# EAGLE design v2 (EAGLE 6.1)
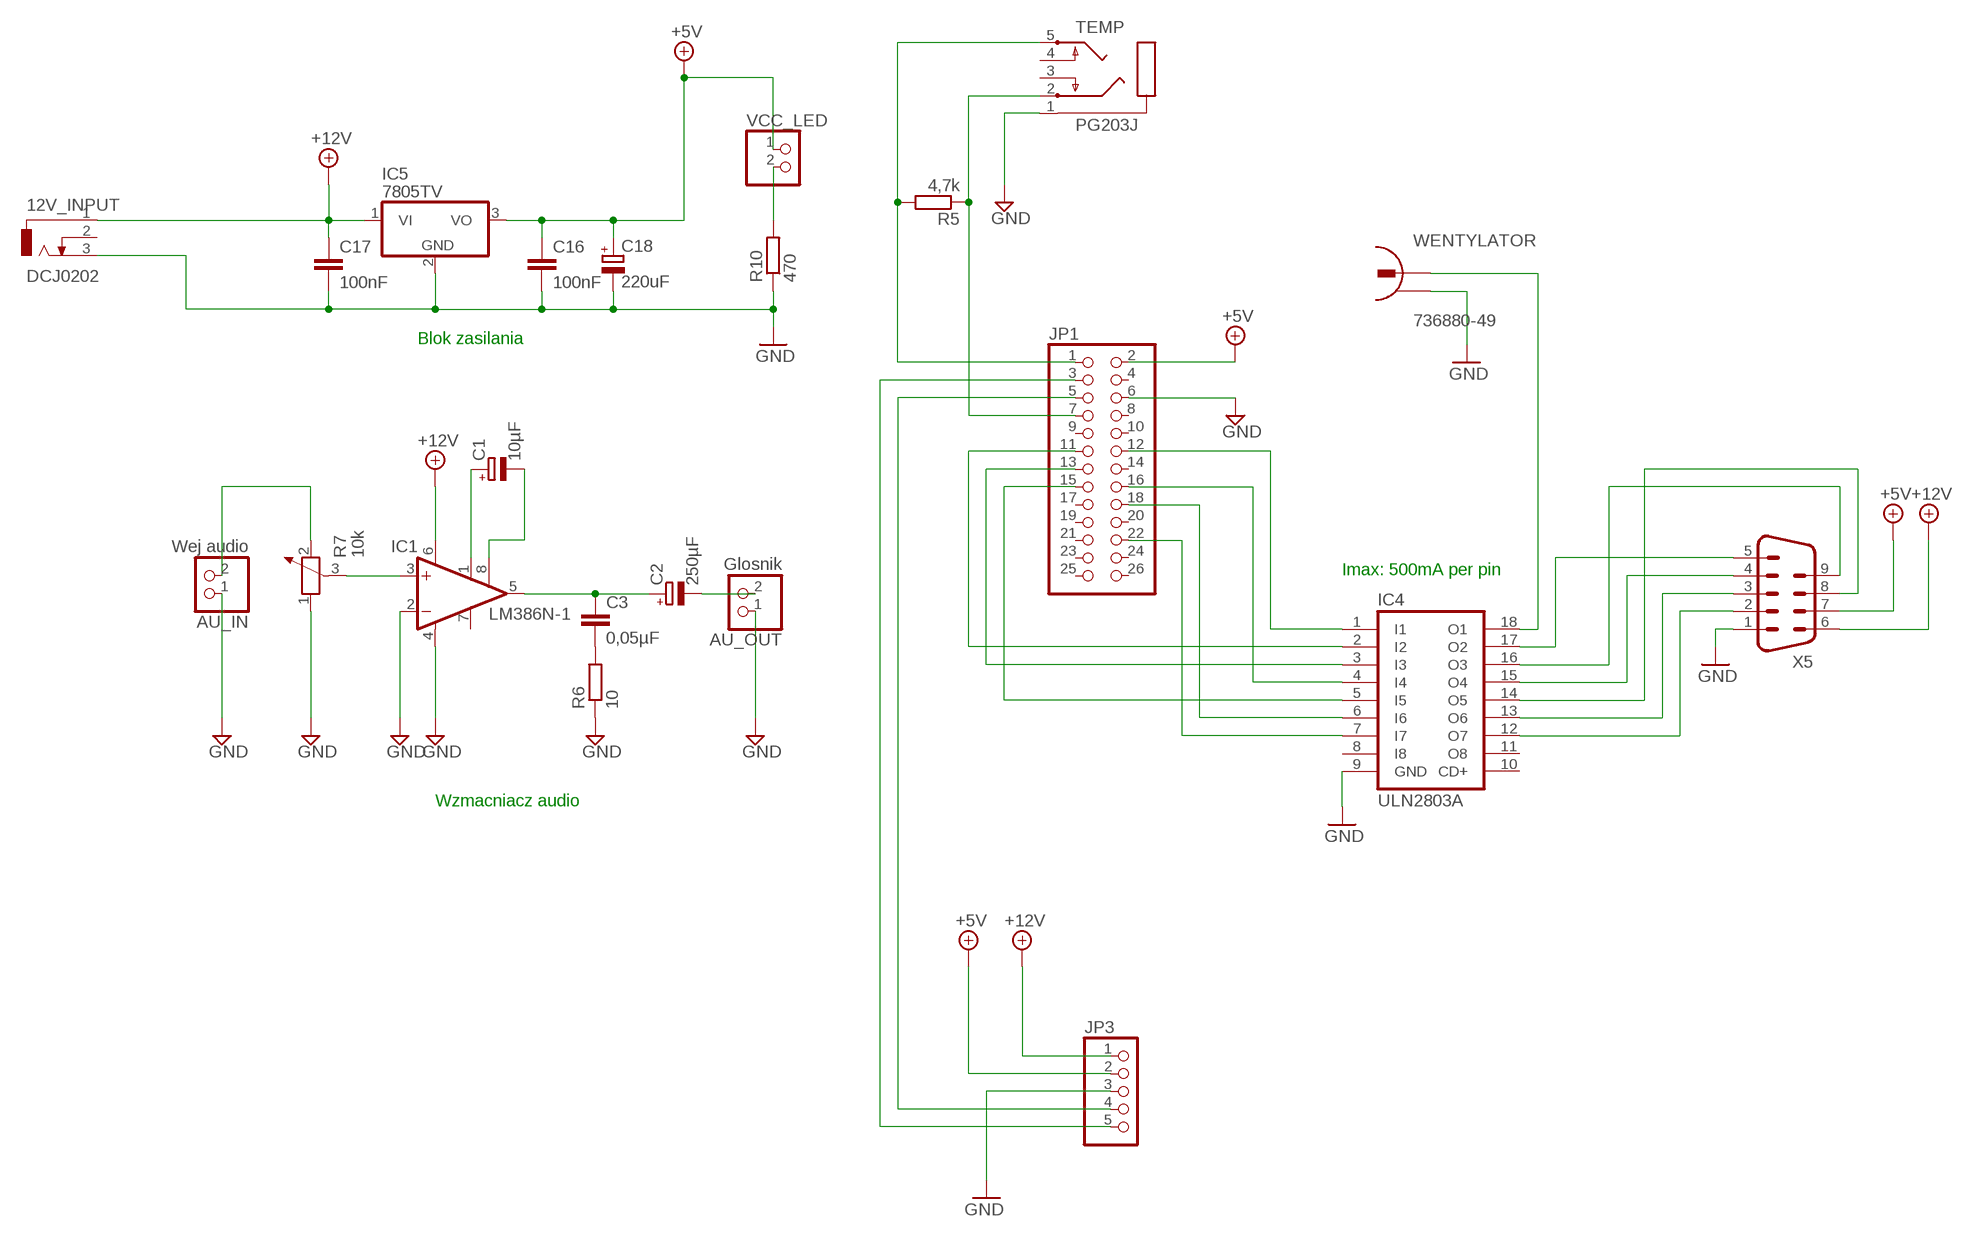
[diagram p0: schematic, sheet 1]

## Parts
12V_INPUT  DCJ0202  [DCJ0202]
AU_IN  Wej audio  PINHD-1X2  [1X02]
AU_OUT  Glosnik  PINHD-1X2  [1X02]
C1  10µF  CPOL-EUE2.5-5  [E2,5-5]
C2  250µF  CPOL-EUE2.5-6  [E2,5-6]
C3  0,05µF  C-EU025-024X044  [C025-024X044]
C16  100nF  C-EU050-024X044  [C050-024X044]
C17  100nF  C-EU050-024X044  [C050-024X044]
C18  220uF  CPOL-EUE2.5-5  [E2,5-5]
IC1  LM386N-1  [DIL08]
IC4  ULN2803A  [DIL18]
IC5  7805TV  [TO220V]
JP1  PINHD-2X13  [2X13]
JP3  PINHD-1X5/90  [1X05/90]
R5  4,7k  R-EU_R1206  [R1206]
R6  10  R-EU_R1206  [R1206]
R7  10k  POTENTIOMETER_PT-10  [PT-10]
R10  470  R-EU_R1206  [R1206]
TEMP  PG203J  [PG203J]
VCC_LED  PINHD-1X2  [1X02]
WENTYLATOR  736880-49  [736880-49]
X5  M09H  [M09H]

## Nets
+5V: C16.1 C18.+ IC5.3(VO) JP1.2 JP3.2 VCC_LED.1 X5.7
+12V: 12V_INPUT.1 C17.1 IC1.6(VS) IC5.1(VI) JP3.1 X5.6
GND: 12V_INPUT.3 AU_IN.1 AU_OUT.1 C16.2 C17.2 C18.- IC1.2(-IN) IC1.4(GND) IC4.9(GND) IC5.2(GND) JP1.6 JP3.3 R6.1 R7.1 R10.1 TEMP.1 WENTYLATOR.2 X5.1
N$1: IC4.3(I3) JP1.13
N$2: IC4.4(I4) JP1.16
N$3: IC4.1(I1) JP1.12
N$4: IC4.13(O6) X5.3
N$5: IC4.16(O3) X5.9
N$6: IC4.12(O7) X5.2
N$7: IC4.7(I7) JP1.22
N$8: IC4.5(I5) JP1.15
N$9: IC4.14(O5) X5.8
N$10: IC4.6(I6) JP1.18
N$11: JP1.1 R5.2 TEMP.5
N$18: JP1.7 R5.1 TEMP.2
N$22: IC4.17(O2) X5.5
N$33: R10.2 VCC_LED.2
N$37: IC4.18(O1) WENTYLATOR.1
N$38: C1.+ IC1.1(GAIN)
N$40: IC4.15(O4) X5.4
N$49: IC4.2(I2) JP1.11
N$59: C1.- IC1.8(GAIN)
N$60: C2.+ C3.1 IC1.5(OUT)
N$61: AU_OUT.2 C2.-
N$62: C3.2 R6.2
N$63: IC1.3(+IN) R7.3
N$64: AU_IN.2 R7.2
SCL: JP1.5 JP3.4
SDA: JP1.3 JP3.5
Unconnected: 12V_INPUT.2 IC1.7(BYPASS) IC4.8(I8) IC4.10(CD+) IC4.11(O8) JP1.4 JP1.8 JP1.9 JP1.10 JP1.14 JP1.17 JP1.19 JP1.20 JP1.21 JP1.23 JP1.24 JP1.25 JP1.26 TEMP.3 TEMP.4 WENTYLATOR.2@2

## Notes on the sheet
- Blok zasilania
- Imax: 500mA per pin
- Wzmacniacz audio

## Library data of the parts
12V_INPUT = con-jack:DCJ0202: DC POWER JACK Source: DCJ0202.pdf
AU_IN AU_OUT VCC_LED = pinhead:PINHD-1X2: PIN HEADER
C1 C2 = rcl:CPOL-EU: POLARIZED CAPACITOR, European symbol
C3 = rcl:C-EU: CAPACITOR, European symbol
C16 C17 = my_library:C-EU: CAPACITOR, European symbol
C18 = my_library:CPOL-EU: POLARIZED CAPACITOR, European symbol
IC1 = linear:LM386?-*: Low Voltage Audio Power Amplifier Source: http://cache.national.com/ds/LM/LM386.pdf
IC4 = uln-udn:ULN2803A: DRIVER ARRAY
IC5 = linear:78*: Positive VOLTAGE REGULATOR Source: http://cache.national.com/ds/LM/LM78L05.pdf http://www.fairchildsemi.com/ds/LM/LM7805.pdf
JP1 = pinhead:PINHD-2X13: PIN HEADER
JP3 = pinhead:PINHD-1X5: PIN HEADER
R5 R6 R10 = rcl:R-EU_: RESISTOR, European symbol
R7 = rcl:POTENTIOMETER_: Potentiometer
TEMP = con-hirschmann:PG203J: MIC/HEADPHONE JACK KS-S stereo microphone/headphone jack PG203JN (Schukat); OC_FARNELL: unknown; OC_NEWARK: unknown
WENTYLATOR = con-conrad:736880-49: Cinch Connector ( RCA Jack )
X5 = con-subd:M09: SUB-D

## Board
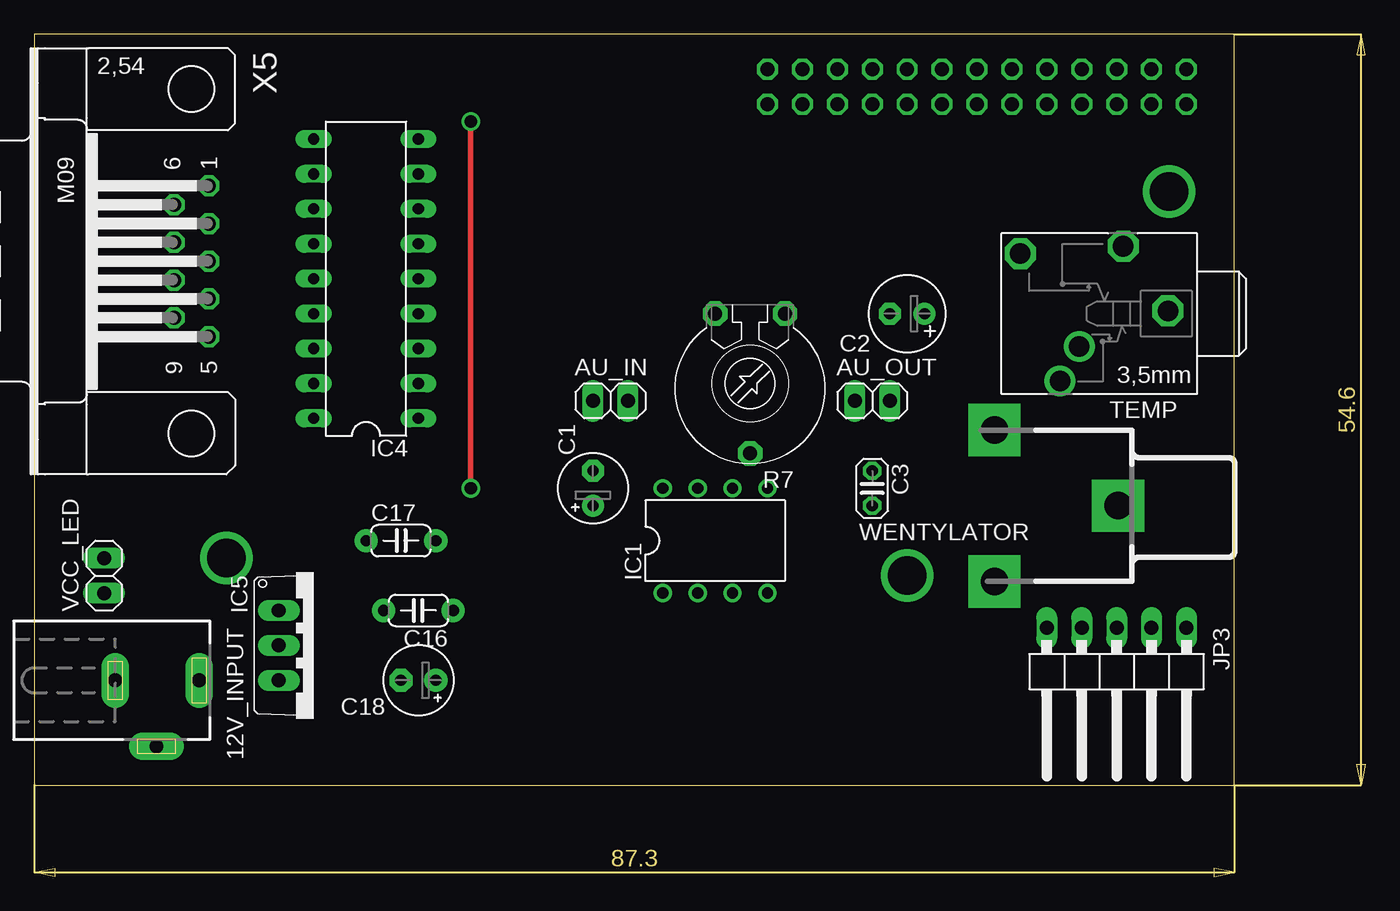
[diagram p1: board, top side]
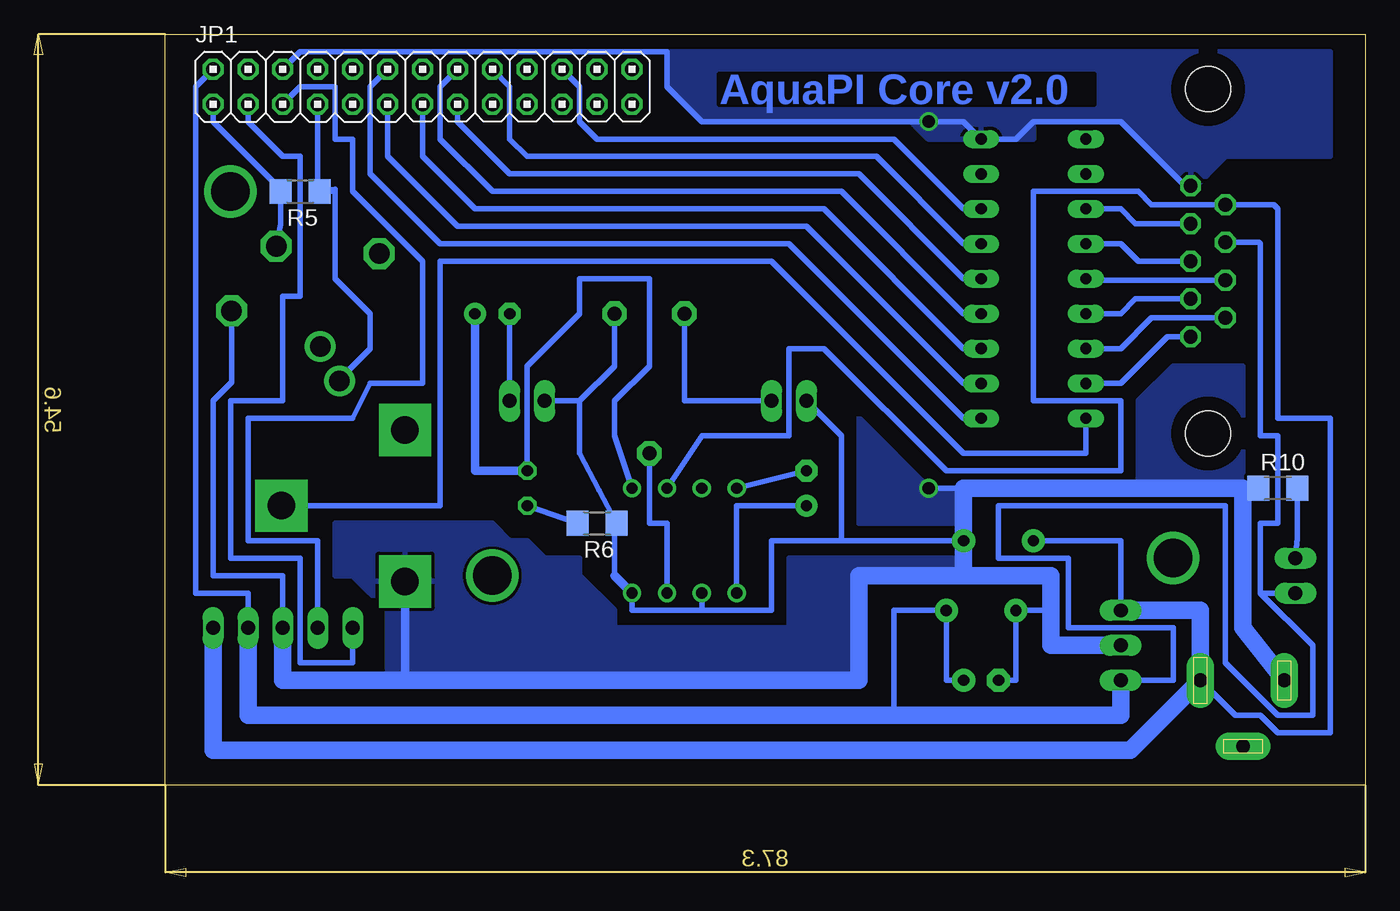
[diagram p2: board, bottom side, seen from below]

Size 87.3 x 54.6 mm. Coordinates in mm from the lower left corner, seen from the top.
Outline: 0,0 87.3,0 87.3,54.6 0,54.6 0,0
Copper layers (1*16): Top 0.035mm / dielectric 1.5mm / Bottom 0.035mm
Design rules: minimum track width 10mil, minimum drill 24mil, track to track 8mil, track to pad 8mil, pad to pad 8mil, via to via 8mil, smd to smd 8mil, copper to edge 40mil, drill to drill 8mil, minimum pad ring 10mil, minimum via ring 8mil, stop-mask expansion 4mil, vias tented up to drill 0mil, thermal gap 10mil

### Footprints (pad centres in the part's own frame; a part is rotated, then mirrored left to right if it is on the bottom)
DCJ0202 = drill 1 pad 2 long: 1 0,3.1; 2 4.8,0; 3 0,-3
1X02 = drill 1.016 long: 1 -1.27,0; 2 1.27,0
E2,5-5 = drill 0.813 pad 1.6: + -1.27,0 | drill 0.813 pad 1.6 octagon: - 1.27,0
E2,5-6 = drill 0.813 pad 1.6: + -1.27,0 | drill 0.813 pad 1.6 octagon: - 1.27,0
C025-024X044 = drill 0.813 octagon: 1 -1.27,0; 2 1.27,0
C050-024X044 = drill 0.813 pad 1.676: 1 -2.54,0; 2 2.54,0
E2,5-5' = drill 0.813 pad 1.676: + -1.27,0 | drill 0.813 pad 1.676 octagon: - 1.27,0
DIL08 = drill 0.813 pad 1.27: 1 -3.81,-3.81; 2 -1.27,-3.81; 3 1.27,-3.81; 4 3.81,-3.81; 5 3.81,3.81; 6 1.27,3.81; 7 -1.27,3.81; 8 -3.81,3.81
DIL18 = drill 0.813 long: 1 -10.16,-3.81; 2 -7.62,-3.81; 3 -5.08,-3.81; 4 -2.54,-3.81; 5 0,-3.81; 6 2.54,-3.81; 7 5.08,-3.81; 8 7.62,-3.81; 9 10.16,-3.81; 10 10.16,3.81; 11 7.62,3.81; 12 5.08,3.81; 13 2.54,3.81; 14 0,3.81; 15 -2.54,3.81; 16 -5.08,3.81; 17 -7.62,3.81; 18 -10.16,3.81
TO220V = drill 1.016 long: 1 -2.54,-2.54; 2 0,-2.54; 3 2.54,-2.54
2X13 = drill 1.016 octagon: 1 -15.24,-1.27; 2 -15.24,1.27; 3 -12.7,-1.27; 4 -12.7,1.27; 5 -10.16,-1.27; 6 -10.16,1.27; 7 -7.62,-1.27; 8 -7.62,1.27; 9 -5.08,-1.27; 10 -5.08,1.27; 11 -2.54,-1.27; 12 -2.54,1.27; 13 0,-1.27; 14 0,1.27; 15 2.54,-1.27; 16 2.54,1.27; 17 5.08,-1.27; 18 5.08,1.27; 19 7.62,-1.27; 20 7.62,1.27; 21 10.16,-1.27; 22 10.16,1.27; 23 12.7,-1.27; 24 12.7,1.27; 25 15.24,-1.27; 26 15.24,1.27
1X05/90 = drill 1.016 long: 1 -5.08,-3.81; 2 -2.54,-3.81; 3 0,-3.81; 4 2.54,-3.81; 5 5.08,-3.81
R1206 = smd 1.6 x 1.803: 1 -1.422,0; 2 1.422,0
PT-10 = drill 1.016 pad 1.778 octagon: 1 -2.54,-5.08; 2 2.54,-5.08; 3 0,5.08
PG203J = drill 1.499 octagon: 1 -5.004,-0.203; 4 5.74,-4.369; 5 -1.753,-4.902 | drill 1.499: 2 2.845,4.902; 3 1.448,2.388
736880-49 = drill 2 pad 3.81 square: 1 -3.92,0; 2 5.08,5.5; 2@2 5.08,-5.5
M09H = drill 1.016 octagon: 1 -5.486,1.27; 2 -2.743,1.27; 3 0,1.27; 4 2.743,1.27; 5 5.486,1.27; 6 -4.115,-1.27; 7 -1.372,-1.27; 8 1.372,-1.27; 9 4.115,-1.27 | hole 3.302: 12.522,0; -12.522,0

### Placement (x,y rotation side)
12V_INPUT  8.89,7.62 270 top
AU_IN  41.91,27.94 0 top
AU_OUT  60.96,27.94 0 top
C1  40.64,21.59 90 top
C2  63.5,34.29 180 top
C3  60.96,21.59 270 top
C16  27.94,12.7 180 top
C17  26.67,17.78 0 top
C18  220uF  [E2,5-5']  27.94,7.62 180 top
IC1  49.53,17.78 0 top
IC4  24.13,36.83 90 top
IC5  20.32,10.16 270 top
JP1  68.58,50.8 0 bottom
JP3  78.74,7.62 180 top
R5  77.47,43.18 180 bottom
R6  55.88,19.05 180 bottom
R7  52.07,29.21 180 top
R10  6.35,21.59 0 bottom
TEMP  77.47,34.29 180 top
VCC_LED  5.08,15.24 90 top
WENTYLATOR  74.93,20.32 180 top
X5  11.43,38.1 270 top

### Tracks (layer width: path | path; a pad name or v marks a point on that pad's centre or on a via)
+5V
  Bottom 0.406: C18.+ 30.48,7.62 C16.1 34.29,12.7 34.29,5.08 | JP1.2 85.09,50.8 85.09,13.97 81.28,13.97 JP3.2 | IC5.3 13.97,7.62 13.97,11.43 21.59,11.43 21.59,16.51 26.67,16.51 26.67,20.32 10.16,20.32 10.16,8.89 6.35,5.08 3.81,5.08 3.81,10.16 7.62,13.97 | X5.7 7.72,39.47 7.62,39.37 7.62,25.4 6.35,25.4 6.35,19.05 7.62,19.05 7.62,13.97 | 7.62,13.97 VCC_LED.1
  Bottom 1.27: JP3.2 81.28,5.08 34.29,5.08 17.78,5.08 IC5.3
+12V
  Bottom 0.406: C17.1 17.78,17.78 IC5.1 | 12V_INPUT.1 9.45,5.08 7.62,5.08 6.35,3.81 2.54,3.81 2.54,26.67 6.35,26.67 6.35,41.91 6.66,42.22 X5.6 15.55,42.22 16.51,43.18 24.13,43.18 24.13,27.94 17.78,27.94 17.78,22.86 30.48,22.86 39.37,31.75 41.91,31.75 41.91,25.4 48.26,25.4 IC1.6
  Bottom 1.27: JP3.1 83.82,2.54 17.07,2.54 12V_INPUT.1 11.99,12.7 IC5.1
GND  (via drill 0.9)
  Top 0.406: v31.75,48.26 v31.75,21.59
  Bottom 0.406: X5.1 13.11,43.59 17.78,48.26 24.13,48.26 25.4,46.99 IC4.9 29.21,48.26 v31.75,48.26 48.26,48.26 50.8,50.8 50.8,53.34 77.47,53.34 JP1.6 | C18.- 25.4,7.62 C16.2 22.86,12.7 | 54.61,15.24 54.61,18.9 R6.1 55.73,21.44 57.15,24.13 57.15,27.94 | 57.15,27.94 AU_OUT.1 | R7.1 54.61,30.48 57.15,27.94 | IC1.4 53.34,12.7 48.26,12.7 | 48.26,12.7 IC1.2 | AU_IN.1 38.1,25.4 38.1,17.78 | 38.1,17.78 43.18,17.78 43.18,12.7 48.26,12.7 | C17.2 38.1,17.78 | TEMP.1 82.47,29.29 83.82,27.94 83.82,15.24 78.74,15.24 JP3.3 | R10.1 8.89,21.59 | v31.75,21.59 29.21,21.59
  Bottom 0.61: WENTYLATOR.2 69.85,7.62 | IC1.4 54.61,15.24
  Bottom 1.27: JP3.3 78.74,7.62 69.85,7.62 36.83,7.62 36.83,15.24 29.21,15.24 | IC5.2 22.86,10.16 22.86,12.7 22.86,15.24 29.21,15.24 | 29.21,15.24 C17.2 29.21,21.59 8.89,21.59 8.89,11.43 12V_INPUT.3
  pour Bottom: 29.21,19.05 36.83,19.05 36.83,26.67 31.75,21.59 29.21,21.59
  pour Bottom: 29.21,16.51 41.91,16.51 41.91,11.43 54.61,11.43 54.61,12.7 57.15,15.24 57.15,16.51 59.69,16.51 60.96,17.78 62.23,17.78 63.5,19.05 73.66,19.05 74.93,19.05 74.93,15.24 73.66,15.24 71.12,12.7 71.12,7.62 36.83,7.62 36.83,15.24 29.21,15.24
  pour Bottom: 16.51,21.59 16.51,27.94 13.97,30.48 8.89,30.48 8.89,21.59
  pour Bottom: 50.8,53.34 2.54,53.34 2.54,45.72 10.16,45.72 12.7,43.18 17.78,48.26 24.13,48.26 24.13,46.99 31.75,46.99 33.02,48.26 48.26,48.26 50.8,50.8
N$1
  Bottom 0.406: IC4.3 29.21,31.75 39.37,41.91 64.77,41.91 68.58,45.72 JP1.13
N$2
  Bottom 0.406: IC4.4 29.21,34.29 38.1,43.18 63.5,43.18 67.31,46.99 67.31,50.8 JP1.16
N$3
  Bottom 0.406: IC4.1 29.21,26.67 41.91,39.37 67.31,39.37 72.39,44.45 72.39,50.8 JP1.12
N$4
  Bottom 0.406: X5.3 16.51,38.1 17.78,39.37 IC4.13
N$5
  Bottom 0.406: X5.9 15.55,33.98 17.78,31.75 IC4.16
N$6
  Bottom 0.406: X5.2 16.71,40.84 17.78,41.91 IC4.12
N$7
  Bottom 0.406: JP1.22 57.15,50.8 57.15,48.26 55.88,46.99 34.29,46.99 29.21,41.91 IC4.7
N$8
  Bottom 0.406: IC4.5 29.21,36.83 36.83,44.45 62.23,44.45 66.04,48.26 JP1.15
N$9
  Bottom 0.406: X5.8 20.22,36.73 IC4.14
N$10
  Bottom 0.406: JP1.18 62.23,50.8 62.23,46.99 60.96,45.72 35.56,45.72 29.21,39.37 IC4.6
N$11
  Bottom 0.406: TEMP.5 78.89,40.79 R5.2 78.74,43.18 83.82,48.26 JP1.1
N$12  (via drill 2.8)
  other vias: 13.97,16.51
N$13  (via drill 2.8)
  other vias: 82.55,43.18
N$14  (via drill 2.8)
  other vias: 63.5,15.24
N$18
  Bottom 0.406: TEMP.2 74.62,29.51 72.39,31.75 72.39,34.29 74.93,36.83 74.93,43.18 | JP1.7 76.2,43.18 74.93,43.18 | 74.93,43.18 74.93,43.33 R5.1
N$22
  Bottom 0.406: X5.5 14.38,32.61 17.78,29.21 IC4.17
N$33
  Bottom 0.406: R10.2 4.93,17.93 VCC_LED.2
N$37
  Bottom 0.406: IC4.18 20.32,24.13 29.21,24.13 43.18,38.1 67.31,38.1 67.31,20.32 WENTYLATOR.1
N$38
  Bottom 0.406: C1.+ 45.72,20.32 IC1.1
N$40
  Bottom 0.406: X5.4 16.71,35.36 17.78,34.29 IC4.15
N$49
  Bottom 0.406: IC4.2 29.21,29.21 40.64,40.64 66.04,40.64 71.12,45.72 JP1.11
N$59
  Bottom 0.406: C1.- IC1.8
N$60
  Bottom 0.406: IC1.5 54.61,25.4 54.61,27.94 52.07,30.48 52.07,36.83 57.15,36.83 57.15,34.29 60.96,30.48 C3.1
  Bottom 0.61: C2.+ 64.77,22.86 C3.1
N$61
  Bottom 0.406: C2.- AU_OUT.2
N$62
  Bottom 0.406: R6.2 C3.2
N$63
  Bottom 0.406: R7.3 52.07,19.05 50.8,19.05 IC1.3
N$64
  Bottom 0.406: AU_IN.2 49.53,27.94 R7.2
SCL
  Bottom 0.406: JP1.5 77.47,50.8 74.93,50.8 74.93,46.99 73.66,46.99 73.66,43.18 68.58,38.1 68.58,29.21 72.39,29.21 73.66,26.67 81.28,26.67 81.28,17.78 76.2,17.78 JP3.4
SDA
  Bottom 0.406: JP1.3 81.28,48.26 78.74,45.72 77.47,45.72 77.47,35.56 78.74,35.56 78.74,27.94 82.55,27.94 82.55,16.51 77.47,16.51 77.47,8.89 73.66,8.89 JP3.5

### Text on the board
Bottom: AquaPI Core v2.0